# EAGLE design simhid-g1000_right (EAGLE 9.6.2)
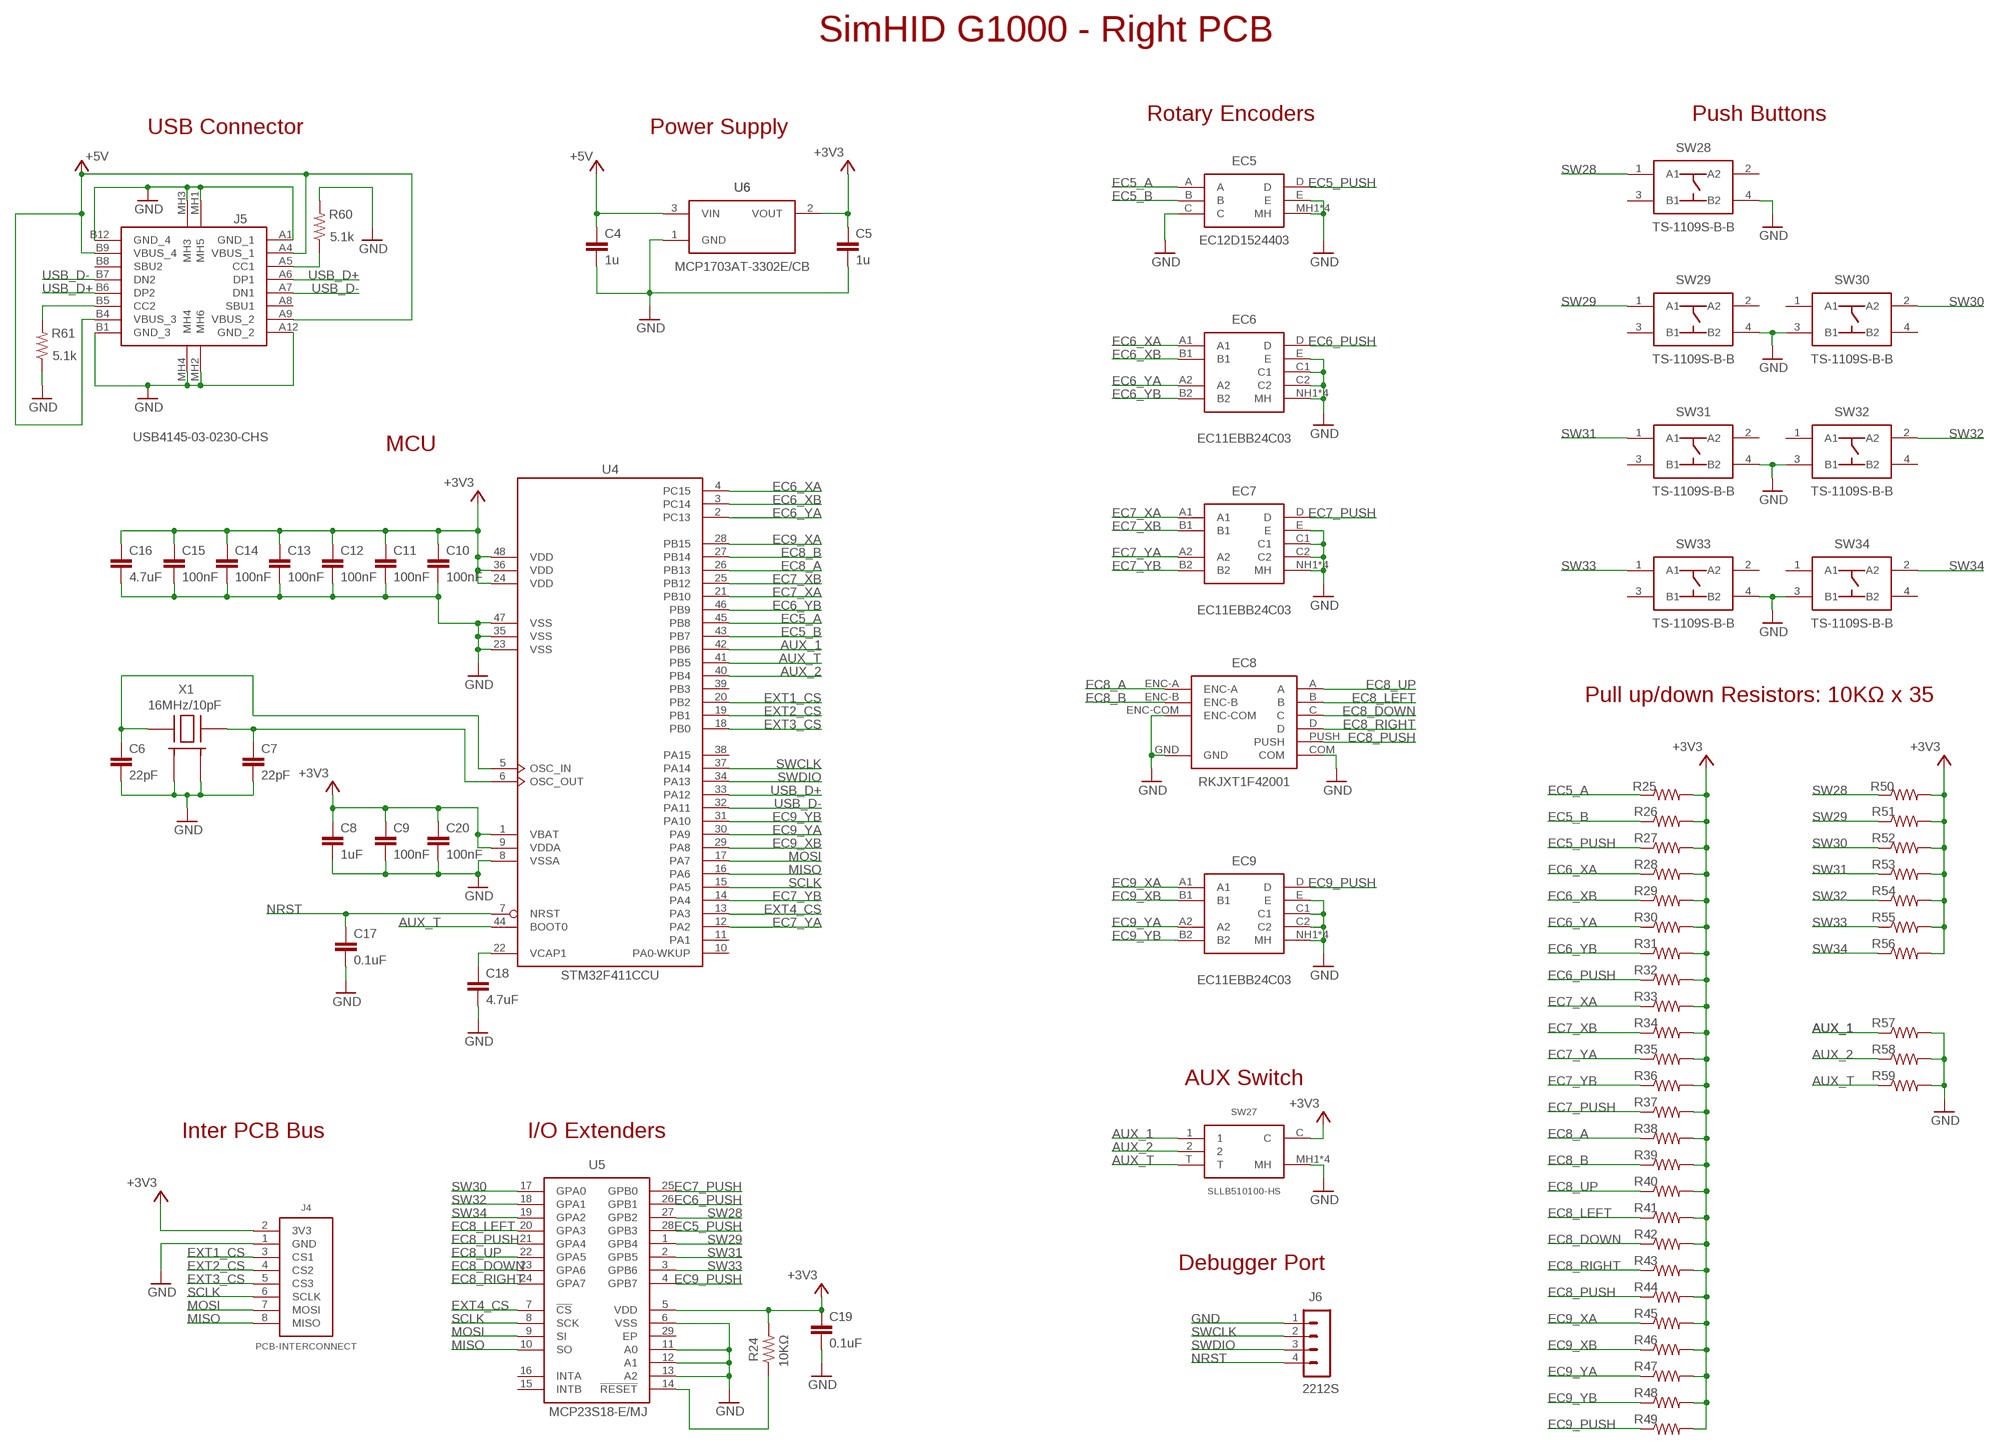
[diagram p0: schematic, sheet 1]

## Parts
C4  1u  RCL_C-EUC0402-HS  [RCL_C0402_HS]
C5  1u  RCL_C-EUC0402-HS  [RCL_C0402_HS]
C6  22pF  RCL_C-EUC0402-HS  [RCL_C0402_HS]
C7  22pF  RCL_C-EUC0402-HS  [RCL_C0402_HS]
C8  1uF  RCL_C-EUC0402-HS  [RCL_C0402_HS]
C9  100nF  RCL_C-EUC0402-HS  [RCL_C0402_HS]
C10  100nF  RCL_C-EUC0402-HS  [RCL_C0402_HS]
C11  100nF  RCL_C-EUC0402-HS  [RCL_C0402_HS]
C12  100nF  RCL_C-EUC0402-HS  [RCL_C0402_HS]
C13  100nF  RCL_C-EUC0402-HS  [RCL_C0402_HS]
C14  100nF  RCL_C-EUC0402-HS  [RCL_C0402_HS]
C15  100nF  RCL_C-EUC0402-HS  [RCL_C0402_HS]
C16  4.7uF  RCL_C-EUC0402-HS  [RCL_C0402_HS]
C17  0.1uF  RCL_C-EUC0402-HS  [RCL_C0402_HS]
C18  4.7uF  RCL_C-EUC0402-HS  [RCL_C0402_HS]
C19  0.1uF  RCL_C-EUC0402-HS  [RCL_C0402_HS]
C20  100nF  RCL_C-EUC0402-HS  [RCL_C0402_HS]
EC5  EC12D1524403  [EC12D1524403]
EC6  EC11EBB24C03  [EC11EBB24C03]
EC7  EC11EBB24C03  [EC11EBB24C03]
EC8  RKJXT1F42001  [RKJXT1F42001]
EC9  EC11EBB24C03  [EC11EBB24C03]
J4  PCB-INTERCONNECT  [PCB-INTERCONNECT]
J5  USB4145-03-0230-CHS  [USB4145030230C-HS]
J6  2212S  53047-0410  [53047-0410]
R24  10KΩ  RCL_R-US_R0402-HS  [RCL_R0402_HS]
R25  RCL_R-US_R0402-HS  [RCL_R0402_HS]
R26  RCL_R-US_R0402-HS  [RCL_R0402_HS]
R27  RCL_R-US_R0402-HS  [RCL_R0402_HS]
R28  RCL_R-US_R0402-HS  [RCL_R0402_HS]
R29  RCL_R-US_R0402-HS  [RCL_R0402_HS]
R30  RCL_R-US_R0402-HS  [RCL_R0402_HS]
R31  RCL_R-US_R0402-HS  [RCL_R0402_HS]
R32  RCL_R-US_R0402-HS  [RCL_R0402_HS]
R33  RCL_R-US_R0402-HS  [RCL_R0402_HS]
R34  RCL_R-US_R0402-HS  [RCL_R0402_HS]
R35  RCL_R-US_R0402-HS  [RCL_R0402_HS]
R36  RCL_R-US_R0402-HS  [RCL_R0402_HS]
R37  RCL_R-US_R0402-HS  [RCL_R0402_HS]
R38  RCL_R-US_R0402-HS  [RCL_R0402_HS]
R39  RCL_R-US_R0402-HS  [RCL_R0402_HS]
R40  RCL_R-US_R0402-HS  [RCL_R0402_HS]
R41  RCL_R-US_R0402-HS  [RCL_R0402_HS]
R42  RCL_R-US_R0402-HS  [RCL_R0402_HS]
R43  RCL_R-US_R0402-HS  [RCL_R0402_HS]
R44  RCL_R-US_R0402-HS  [RCL_R0402_HS]
R45  RCL_R-US_R0402-HS  [RCL_R0402_HS]
R46  RCL_R-US_R0402-HS  [RCL_R0402_HS]
R47  RCL_R-US_R0402-HS  [RCL_R0402_HS]
R48  RCL_R-US_R0402-HS  [RCL_R0402_HS]
R49  RCL_R-US_R0402-HS  [RCL_R0402_HS]
R50  RCL_R-US_R0402-HS  [RCL_R0402_HS]
R51  RCL_R-US_R0402-HS  [RCL_R0402_HS]
R52  RCL_R-US_R0402-HS  [RCL_R0402_HS]
R53  RCL_R-US_R0402-HS  [RCL_R0402_HS]
R54  RCL_R-US_R0402-HS  [RCL_R0402_HS]
R55  RCL_R-US_R0402-HS  [RCL_R0402_HS]
R56  RCL_R-US_R0402-HS  [RCL_R0402_HS]
R57  RCL_R-US_R0402-HS  [RCL_R0402_HS]
R58  RCL_R-US_R0402-HS  [RCL_R0402_HS]
R59  RCL_R-US_R0402-HS  [RCL_R0402_HS]
R60  5.1k  RCL_R-US_R0402-HS  [RCL_R0402_HS]
R61  5.1k  RCL_R-US_R0402-HS  [RCL_R0402_HS]
SW27  SLLB510100-HS  [SLLB510100-HS]
SW28  TS-1109S-B-B  [TS-1109S-B-B]
SW29  TS-1109S-B-B  [TS-1109S-B-B]
SW30  TS-1109S-B-B  [TS-1109S-B-B]
SW31  TS-1109S-B-B  [TS-1109S-B-B]
SW32  TS-1109S-B-B  [TS-1109S-B-B]
SW33  TS-1109S-B-B  [TS-1109S-B-B]
SW34  TS-1109S-B-B  [TS-1109S-B-B]
U4  STM32F411CCU  [UFQFPN48]
U5  MCP23S18-E/MJ  MCP23S17-E_ML  [QFN65P600X600X100-29N]
U6  MCP1703AT-3302E/CB  LDO-REGULATOR  [SOT23]
X1  16MHz/10pF  CRYSTAL3225HS  [CRYSTAL3225-HS]

## Nets
+3V3 [pwr]: C5.1 C8.1 C9.1 C10.1 C11.1 C12.1 C13.1 C14.1 C15.1 C16.1 C19.1 C20.1 J4.2(3V3) R24.2 R25.2 R26.2 R27.2 R28.2 R29.2 R30.2 R31.2 R32.2 R33.2 R34.2 R35.2 R36.2 R37.2 R38.2 R39.2 R40.2 R41.2 R42.2 R43.2 R44.2 R45.2 R46.2 R47.2 R48.2 R49.2 R50.2 R51.2 R52.2 R53.2 R54.2 R55.2 R56.2 SW27.C U4.1(VBAT) U4.9(VDDA) U4.24(VDD) U4.36(VDD) U4.48(VDD) U5.5(VDD) U6.2(VOUT)
+5V [pwr]: C4.1 J5.A4(VBUS_1) J5.A9(VBUS_2) J5.B4(VBUS_3) J5.B9(VBUS_4) U6.3(VIN)
AUX_1: R57.1 SW27.1 U4.42(PB6)
AUX_2: R58.1 SW27.2 U4.40(PB4)
AUX_T: R59.1 SW27.T U4.41(PB5) U4.44(BOOT0)
EC5_A: EC5.A R25.1 U4.45(PB8)
EC5_B: EC5.B R26.1 U4.43(PB7)
EC5_PUSH: EC5.D R27.1 U5.28(GPB3)
EC6_PUSH: EC6.D R32.1 U5.26(GPB1)
EC6_XA: EC6.A1 R28.1 U4.4(PC15)
EC6_XB: EC6.B1 R29.1 U4.3(PC14)
EC6_YA: EC6.A2 R30.1 U4.2(PC13)
EC6_YB: EC6.B2 R31.1 U4.46(PB9)
EC7_PUSH: EC7.D R37.1 U5.25(GPB0)
EC7_XA: EC7.A1 R33.1 U4.21(PB10)
EC7_XB: EC7.B1 R34.1 U4.25(PB12)
EC7_YA: EC7.A2 R35.1 U4.12(PA2)
EC7_YB: EC7.B2 R36.1 U4.14(PA4)
EC8_A: EC8.ENC-A R38.1 U4.26(PB13)
EC8_B: EC8.ENC-B R39.1 U4.27(PB14)
EC8_DOWN: EC8.C R42.1 U5.23(GPA6)
EC8_LEFT: EC8.B R41.1 U5.20(GPA3)
EC8_PUSH: EC8.PUSH R44.1 U5.21(GPA4)
EC8_RIGHT: EC8.D R43.1 U5.24(GPA7)
EC8_UP: EC8.A R40.1 U5.22(GPA5)
EC9_PUSH: EC9.D R49.1 U5.4(GPB7)
EC9_XA: EC9.A1 R45.1 U4.28(PB15)
EC9_XB: EC9.B1 R46.1 U4.29(PA8)
EC9_YA: EC9.A2 R47.1 U4.30(PA9)
EC9_YB: EC9.B2 R48.1 U4.31(PA10)
EXT1_CS: J4.3(CS1) U4.20(PB2)
EXT2_CS: J4.4(CS2) U4.19(PB1)
EXT3_CS: J4.5(CS3) U4.18(PB0)
EXT4_CS: U4.13(PA3) U5.7(!CS)
GND [gnd]: C4.2 C5.2 C6.2 C7.2 C8.2 C9.2 C10.2 C11.2 C12.2 C13.2 C14.2 C15.2 C16.2 C17.2 C18.2 C19.2 C20.2 EC5.C EC5.E EC5.MH1(MH) EC5.MH2(MH) EC5.MH3(MH) EC5.MH4(MH) EC6.C1 EC6.C2 EC6.E EC6.NH1(MH) EC6.NH2(MH) EC6.NH3(MH) EC6.NH4(MH) EC7.C1 EC7.C2 EC7.E EC7.NH1(MH) EC7.NH2(MH) EC7.NH3(MH) EC7.NH4(MH) EC8.COM EC8.ENC-COM EC8.GND EC9.C1 EC9.C2 EC9.E EC9.NH1(MH) EC9.NH2(MH) EC9.NH3(MH) EC9.NH4(MH) J4.1(GND) J5.A1(GND_1) J5.A12(GND_2) J5.B1(GND_3) J5.B12(GND_4) J5.MH1(MH5) J5.MH2(MH6) J5.MH3 J5.MH4 J6.1 R57.2 R58.2 R59.2 R60.2 R61.1 SW27.MH1(MH) SW27.MH2(MH) SW27.MH3(MH) SW27.MH4(MH) SW28.4(B2) SW29.4(B2) SW30.3(B1) SW31.4(B2) SW32.3(B1) SW33.4(B2) SW34.3(B1) U4.8(VSSA) U4.23(VSS) U4.35(VSS) U4.47(VSS) U5.6(VSS) U5.11(A0) U5.12(A1) U5.13(A2) U6.1(GND) X1.2(GND_1) X1.4(GND_2)
MISO: J4.8(MISO) U4.16(PA6) U5.10(SO)
MOSI: J4.7(MOSI) U4.17(PA7) U5.9(SI)
N$1: R24.1 U5.14(!RESET)
N$3: J5.A5(CC1) R60.1
N$4: J5.B5(CC2) R61.2
NRST: C17.1 J6.4 U4.7(NRST)
OSC_IN: C6.1 U4.5(OSC_IN) X1.1(HOT_1)
OSC_OUT: C7.1 U4.6(OSC_OUT) X1.3(HOT_2)
SCLK: J4.6(SCLK) U4.15(PA5) U5.8(SCK)
SW28: R50.1 SW28.1(A1) U5.27(GPB2)
SW29: R51.1 SW29.1(A1) U5.1(GPB4)
SW30: R52.1 SW30.2(A2) U5.17(GPA0)
SW31: R53.1 SW31.1(A1) U5.2(GPB5)
SW32: R54.1 SW32.2(A2) U5.18(GPA1)
SW33: R55.1 SW33.1(A1) U5.3(GPB6)
SW34: R56.1 SW34.2(A2) U5.19(GPA2)
SWCLK: J6.2 U4.37(PA14)
SWDIO: J6.3 U4.34(PA13)
USB_D+: J5.A6(DP1) J5.B6(DP2) U4.33(PA12)
USB_D-: J5.A7(DN1) J5.B7(DN2) U4.32(PA11)
VCAP: C18.1 U4.22(VCAP1)
Unconnected: J5.A8(SBU1) J5.B8(SBU2) SW28.2(A2) SW28.3(B1) SW29.2(A2) SW29.3(B1) SW30.1(A1) SW30.4(B2) SW31.2(A2) SW31.3(B1) SW32.1(A1) SW32.4(B2) SW33.2(A2) SW33.3(B1) SW34.1(A1) SW34.4(B2) U4.10(PA0-WKUP) U4.11(PA1) U4.38(PA15) U4.39(PB3) U5.15(INTB) U5.16(INTA) U5.29(EP)

## Notes on the sheet
- SimHID G1000 - Right PCB
- Rotary Encoders | Push Buttons
- USB Connector | Power Supply
- MCU
- Pull up/down Resistors: 10KΩ x 35
- AUX Switch
- Inter PCB Bus | I/O Extenders
- Debugger Port

## Library data of the parts
C4-C20 = gen-discrete3:RCL_C-EU: CAPACITOR, European symbol
EC5 = RotaryEncoder:EC12D1524403
EC6 EC7 EC9 = RotaryEncoder:EC11EBB24C03
EC8 = RotaryEncoder:RKJXT1F42001
J4 = SimHID-G1000:PCB-INTERCONNECT
J5 = typec_connectors:USB4145-03-0230-C: USB Connectors USB-C Rec 3u" Vert 16P SMT 2.3mm TH stakes H7.46mm T+R+Cap Source: Datasheet <https://gct.co/newark/connector/USB4145>
J6 = connector:53047-0410: HEADER
R24-R61 = gen-discrete3:RCL_R-US_: RESISTOR, American symbol
SW27 = Switches:SLLB510100
SW28-SW34 = Switches:TS-1109S-B-B
U4 = stm32:STM32F411CCU*
U5 = MCP23S17-E_ML:MCP23S17-E_ML: 16-Bit I/O Port Expander SPI 10M QFN28EP Microchip MCP23S17-E/ML, 16-channel 16bit I/O Expander 10MHz, Serial-SPI, 28-Pin QFN Source: Datasheet <http://docs-emea.rs-online.com/webdocs/1169/0900766b811692f9.pdf>; ARROW_PART_NUMBER: MCP23S17-E/ML; ARROW_PRICE-STOCK: https://www.arrow.com/en/products/mcp23s17-eml/microchip-technology; DESCRIPTION: 16-Bit I/O Port Expander SPI 10M QFN28EP Microchip MCP23S17-E/ML, 16-channel 16bit I/O Expander 10MHz, Serial-SPI, 28-Pin QFN; HEIGHT: 1mm; MANUFACTURER_NAME: Microchip; MANUFACTURER_PART_NUMBER: MCP23S17-E/ML; MOUSER_PART_NUMBER: 579-MCP23S17-E/ML; MOUSER_PRICE-STOCK: https://www.mouser.co.uk/ProductDetail/Microchip-Technology/MCP23S17-E-ML/?qs=usxtMOJb1RyqBjk32jXtPQ%3D%3D
U6 = SOT23_Module:LDO-REGULATOR
X1 = CRYSTAL3225:CRYSTAL3225: Crystals 3225

## Net classes
1 gnd: width 0.2 mm
2 pwr: width 0.2 mm

## Board
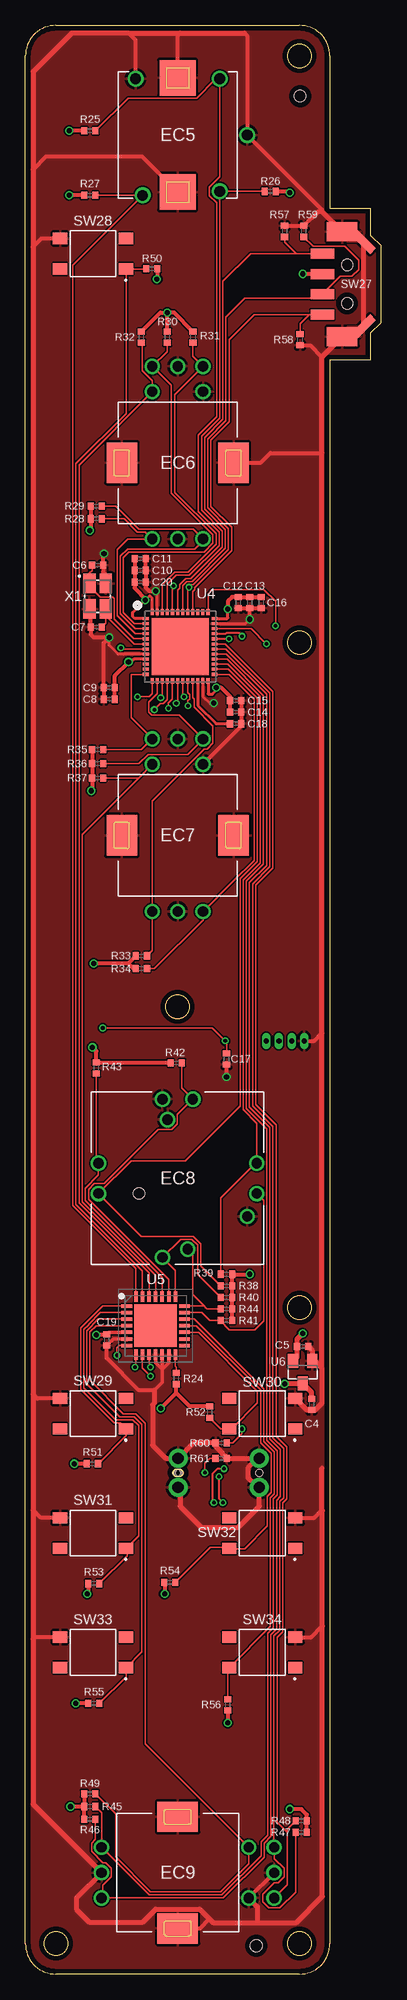
[diagram p1: board, top side]
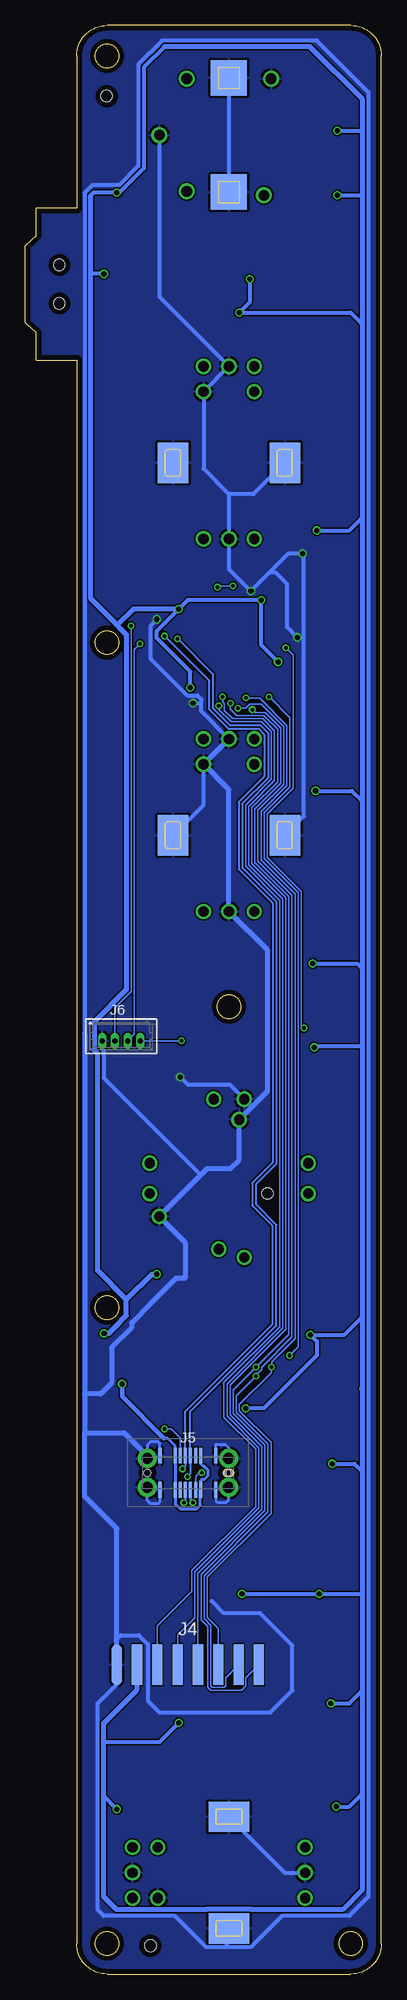
[diagram p2: board, bottom side, seen from below]

Size 35.05 x 192 mm. Coordinates in mm from the lower left corner, seen from the top.
Outline: 30,189 30,174 34,174 34,171.3 35.05,170.3 35.05,162.7 34,161.7 34,159 30,159 30,3 arc-90 27,0 3,0 arc-90 0,3 0,189 arc-90 3,192 27,192 arc-90 30,189
Outline: circle at 27,65.68 radius 1.15
Outline: circle at 27,3 radius 1.15
Outline: circle at 3,3 radius 1.15
Outline: circle at 27,131.19 radius 1.15
Outline: circle at 15,95.3 radius 1.15
Outline: circle at 27,189 radius 1.15
Copper layers (1*16): Top 0.035mm / dielectric 1.6mm / Bottom 0.035mm
Design rules "Elecrow_2-layer_PCB_eagle_rule": minimum track width 6mil, minimum drill 12mil, track to track 6mil, track to pad 6mil, pad to pad 6mil, via to via 8mil, smd to smd 0mil, copper to edge 20mil, drill to drill 10mil, minimum pad ring 6mil, minimum via ring 6mil, stop-mask expansion 0mil, vias tented up to drill 100mil, thermal gap 10mil
Holes 2.3 mm at 27,189 27,131.19 15,95.3 27,65.68 27,3 3,3
Holes 1.15 mm at 27.05,185.04 22.73,2.79

### Footprints (pad centres in the part's own frame; a part is rotated, then mirrored left to right if it is on the bottom)
RCL_C0402_HS = smd 0.6 x 0.7: 1 -0.55,0; 2 0.55,0
EC12D1524403 = drill 1.05: A 5.55,-4.15; B -5.55,-4.15; C 5.55,4.15; D -5.95,3.45; E 0,-6.85 | smd 3.5 x 3.55: MH1 -5.625,0; MH3 5.625,0 | smd 3.5 x 3.55 bottom: MH2 -5.625,0; MH4 5.625,0
EC11EBB24C03 = drill 1: A1 2.5,7.5; A2 2.5,-9.5; B1 -2.5,7.5; B2 -2.5,-9.5; C1 0,7.5; C2 0,-9.5; D 2.5,-7; E -2.5,-7 | smd 3 x 4: NH1 5.5,0; NH3 -5.5,0 | smd 3 x 4 bottom: NH2 5.5,0; NH4 -5.5,0
RKJXT1F42001 = drill 1: A -1.5,-7.8; B 7.8,-1.5; C 1.5,7.8; COM -1,5.78; D -7.8,1.5; ENC-A -7.8,-1.5; ENC-B 7.8,1.5; ENC-COM -1.5,7.8; GND 6.86,-3.75; PUSH 1,-6.98 | hole 1.1: -3.8,-1.5
PCB-INTERCONNECT = smd 1 x 4: 1 -7,0; 2 -5,0; 3 -3,0; 4 -1,0; 5 1,0; 6 3,0; 7 5,0; 8 7,0
USB4145030230C-HS = smd 0.3 x 1.55: A1 -2.75,1.685; A4 -1.25,1.685; A5 -0.75,1.685; A6 -0.25,1.685; A7 0.25,1.685; A8 0.75,1.685; A9 1.25,1.685; A12 2.75,1.685; B1 2.75,-1.685; B4 1.25,-1.685; B5 0.75,-1.685; B6 0.25,-1.685; B7 -0.25,-1.685; B8 -0.75,-1.685; B9 -1.25,-1.685; B12 -2.75,-1.685 | drill 1.1 pad 1.875: MH1 -4,1.43; MH2 4,1.43; MH3 -4,-1.43; MH4 4,-1.43 | hole 0.71: -4,0; 4,0; 4.15,0; 3.85,0
53047-0410 = drill 0.508 long: 1 1.875,0; 2 0.625,0; 3 -0.625,0; 4 -1.875,0
RCL_R0402_HS = smd 0.6 x 0.7: 1 -0.55,0; 2 0.55,0
SLLB510100-HS = smd 1 x 2.3: 1 -3,-1.45; 2 3,-1.45; C -1,-1.45; T 1,-1.45 | smd 2.6 x 0.8 rotated 45: MH1 -4.172,2.616 | smd 2.6 x 0.8 rotated 315: MH2 4.172,2.616 | smd 1.85 x 3: MH3 -5.175,0.5; MH4 5.175,0.5 | hole 1.1: 1.9,1; -1.9,1
TS-1109S-B-B = smd 1.4 x 1.1: 1 -3.25,1.5; 2 3.25,1.5; 3 -3.25,-1.5; 4 3.25,-1.5
UFQFPN48 = smd 0.55 x 0.3: 1 -3.38,2.75; 2 -3.38,2.25; 3 -3.38,1.75; 4 -3.38,1.25; 5 -3.38,0.75; 6 -3.38,0.25; 7 -3.38,-0.25; 8 -3.38,-0.75; 9 -3.38,-1.25; 10 -3.38,-1.75; 11 -3.38,-2.25; 12 -3.38,-2.75; 25 3.38,-2.75; 26 3.38,-2.25; 27 3.38,-1.75; 28 3.38,-1.25; 29 3.38,-0.75; 30 3.38,-0.25; 31 3.38,0.25; 32 3.38,0.75; 33 3.38,1.25; 34 3.38,1.75; 35 3.38,2.25; 36 3.38,2.75 | smd 0.3 x 0.55: 13 -2.75,-3.38; 14 -2.25,-3.38; 15 -1.75,-3.38; 16 -1.25,-3.38; 17 -0.75,-3.38; 18 -0.25,-3.38; 19 0.25,-3.38; 20 0.75,-3.38; 21 1.25,-3.38; 22 1.75,-3.38; 23 2.25,-3.38; 24 2.75,-3.38; 37 2.75,3.38; 38 2.25,3.38; 39 1.75,3.38; 40 1.25,3.38; 41 0.75,3.38; 42 0.25,3.38; 43 -0.25,3.38; 44 -0.75,3.38; 45 -1.25,3.38; 46 -1.75,3.38; 47 -2.25,3.38; 48 -2.75,3.38 | smd 5.6 x 5.6: EXP 0,0
QFN65P600X600X100-29N = smd 1.05 x 0.35: 1 -2.85,1.95; 2 -2.85,1.3; 3 -2.85,0.65; 4 -2.85,0; 5 -2.85,-0.65; 6 -2.85,-1.3; 7 -2.85,-1.95; 15 2.85,-1.95; 16 2.85,-1.3; 17 2.85,-0.65; 18 2.85,0; 19 2.85,0.65; 20 2.85,1.3; 21 2.85,1.95 | smd 0.35 x 1.05: 8 -1.95,-2.85; 9 -1.3,-2.85; 10 -0.65,-2.85; 11 0,-2.85; 12 0.65,-2.85; 13 1.3,-2.85; 14 1.95,-2.85; 22 1.95,2.85; 23 1.3,2.85; 24 0.65,2.85; 25 0,2.85; 26 -0.65,2.85; 27 -1.3,2.85; 28 -1.95,2.85 | smd 4.2 x 4.2: 29 0,0
SOT23 = smd 1 x 1.4: 1 -0.95,-1.1; 2 0.95,-1.1; 3 0,1.1
CRYSTAL3225-HS = smd 1.9 x 1.2: 1 -1.26,-0.8; 2 1.26,-0.8; 3 1.26,0.8; 4 -1.26,0.8

### Placement (x,y rotation side)
C4  28.19,56.13 270 top
C5  27.3,61.85 0 top
C6  7.11,138.81 0 top
C7  6.99,132.72 180 top
C8  8.26,125.6 180 top
C9  8.26,126.75 180 top
C10  11.3,138.3 0 top
C11  11.3,139.45 0 top
C12  20.95,135.13 270 top
C13  22.1,135.13 270 top
C14  20.7,124.33 0 top
C15  20.7,125.48 0 top
C16  23.24,135.13 270 top
C17  19.81,90.17 270 top
C18  20.7,123.19 0 top
C19  8,62.48 270 top
C20  11.3,137.16 0 top
EC5  15,181.2 90 top
EC6  15,148.9 180 top
EC7  15,112.2 180 top
EC8  15,78.4 0 top
EC9  15,10 90 top
J4  19.05,30.48 0 bottom
J5  19.04,49.4 0 bottom
J6  25.6,91.94 180 bottom
R24  14.86,58.67 270 top
R25  6.35,181.61 180 top
R26  24.13,175.64 0 top
R27  6.35,175.26 180 top
R28  6.99,143.38 180 top
R29  6.99,144.65 180 top
R30  13.97,161.29 90 top
R31  16.51,161.29 90 top
R32  11.43,161.29 90 top
R33  11.43,100.33 180 top
R34  11.43,99.06 180 top
R35  7.11,120.65 180 top
R36  7.11,119.25 180 top
R37  7.11,117.86 180 top
R38  19.81,67.82 0 top
R39  19.81,68.96 0 top
R40  19.81,66.67 0 top
R41  19.81,64.39 0 top
R42  14.86,89.79 180 top
R43  6.99,89.28 90 top
R44  19.81,65.53 0 top
R45  6.35,16.51 180 top
R46  6.35,15.24 180 top
R47  27.18,13.97 0 top
R48  27.18,15.11 0 top
R49  6.35,17.78 180 top
R50  12.45,168.02 0 top
R51  6.6,50.29 180 top
R52  18.16,55.37 90 top
R53  6.73,38.48 180 top
R54  14.22,38.61 180 top
R55  6.73,26.67 180 top
R56  19.94,26.54 270 top
R57  25.53,171.7 90 top
R58  27.05,161.04 270 top
R59  27.43,171.7 90 top
R60  19.28,52.32 180 top
R61  19.28,50.8 180 top
SW27  30.7,166.5 270 top
SW28  6.67,169.5 180 top
SW29  6.67,55.22 180 top
SW30  23.33,55.22 180 top
SW31  6.67,43.46 180 top
SW32  23.33,43.46 180 top
SW33  6.67,31.7 180 top
SW34  23.33,31.7 180 top
U4  15.24,130.81 0 top
U5  12.83,63.88 0 top
U6  27.3,59.31 180 top
X1  7.11,135.76 270 top

### Tracks (layer width: path | path; a pad name or v marks a point on that pad's centre or on a via)
+3V3  (via drill 0.5)
  Top 0.3: U4.48 12.49,135.59 12.32,135.76 12.19,135.76 11.87,135.45 v11.81,135.38 10.57,134.15 10.57,133.76 10.78,133.56 U4.1 | U4.24 17.99,126.16 18.03,126.11 18.41,126.11 18.8,126.49 v18.8,126.75 | U4.9 10.69,129.56 10.41,129.29 v10.16,129.29 | U4.36 19.89,133.56 19.94,133.6 v19.94,134.49
  Top 0.35: U5.5 8.2,63.23 C19.1
  Top 0.4: v27.3,167.51 29.24,167.51 SW27.C | R25.2 v4.32,181.61 | R27.2 v4.32,175.26 | R26.2 25.91,175.64 v26.04,175.51 | R30.2 v13.97,163.7 | R32.2 13.29,163.7 v13.97,163.7 | R31.2 14.65,163.7 v13.97,163.7 | R33.2 10.12,99.57 | 10.12,99.57 v6.73,99.57 | R34.2 10.63,99.06 10.12,99.57 | R35.2 R36.2 R37.2 6.56,116.67 v6.48,116.59 | R41.2 R44.2 R40.2 R38.2 R39.2 v22.1,68.96 | R42.2 7.03,89.79 R43.2 6.99,90.93 v6.6,91.31 | R47.2 R48.2 27.73,15.71 27.18,16.26 v26.04,16.26 | R49.2 R45.2 | R46.2 R45.2 | R45.2 v4.45,16.51 | R50.2 13,167.05 v12.95,167 | R51.2 v4.83,50.29 | R55.2 v4.95,26.67 | R56.2 v19.94,24.77 | C8.1 C9.1 8.8,127.93 v10.16,129.29 | R29.2 R28.2 6.43,142.32 v6.35,142.24 | C11.1 C10.1 C20.1 10.75,136.57 11.87,135.45 | v19.94,134.49 19.94,135.25 20.36,135.68 C12.1 C13.1 C16.1 | v18.8,126.75 19.3,126.75 20.15,125.9 C15.1 C14.1 | v13.34,55.75 14.86,57.28 | 14.86,57.28 R24.2 | R52.2 16.21,55.92 14.86,57.28 | v6.99,62.99 7.03,63.03 C19.1 | R54.2 13.72,38.57 v13.72,37.47 | R53.2 6.18,37.55 v6.1,37.47
  Top 0.5: U6.2 26.75,60.81 C5.1 26.75,62.57 v27.3,63.12
  Bottom 0.4: v27.3,167.51 28.48,167.51 28.61,167.64 | 28.61,175.26 28.35,175.51 v26.04,175.51 25.78,175.51 23.37,177.93 23.37,187.87 21.34,189.9 | v4.32,175.26 1.87,175.26 | v4.32,181.61 1.87,181.61 | 2,57.66 1.87,57.78 | 1.87,162.56 3.02,163.7 v13.97,163.7 12.95,164.72 v12.95,167 | v6.73,99.57 2.38,99.57 1.87,99.06 | v6.48,116.59 2.89,116.59 1.87,115.57 | v22.1,68.96 22.6,68.96 | v6.6,91.31 6.48,91.44 1.87,91.44 | v26.04,16.26 27.34,17.56 27.34,17.78 | v4.45,16.51 3.14,16.51 1.87,17.78 | v4.83,50.29 2.63,50.29 1.87,49.53 | v13.72,37.47 v6.1,37.47 1.87,37.47 | v4.95,26.67 3.14,26.67 1.87,27.94 | v19.94,24.77 21.84,22.86 27.34,22.86 | v6.35,142.24 3.14,142.24 1.87,143.51 | v18.8,126.75 18.8,128.32 22.14,131.67 22.14,132.29 v19.94,134.49 19.05,135.38 v11.81,135.38 11.81,130.94 v10.16,129.29 | 1.87,64.77 3.65,62.99 v6.99,62.99 6.35,62.36 6.35,60.96 11.56,55.75 v13.34,55.75
  Bottom 0.5: 25.99,132.89 25.59,132.49 25.59,132.48 25.09,131.98 25.09,97 28.28,93.81 28.28,91.02 27.94,90.68 27.94,69.32 25.09,66.48 | 25.99,132.89 28.61,135.51 28.61,167.64 28.61,175.26 | J4.2 24.05,28.02 27.34,24.73 27.34,22.86 27.34,17.78 27.34,7.62 26.07,6.35 21.52,6.35 17.22,6.35 17.17,6.4 12.83,6.4 12.78,6.35 3.81,6.35 1.87,8.29 1.87,17.78 1.87,27.94 1.87,37.47 1.87,49.53 1.87,57.78 1.87,64.77 1.87,91.44 1.87,99.06 1.87,115.57 1.87,143.51 1.87,162.56 1.87,175.26 1.87,181.61 1.87,184.75 7.02,189.9 21.34,189.9 | v19.94,134.49 24.38,134.49 25.99,132.89 | 25.09,66.48 25.09,64.89 25.59,64.39 25.65,64.32 25.71,64.27 26.86,63.12 v27.3,63.12 | 22.6,68.96 22.61,68.96 25.09,66.48
+5V  (via drill 0.5)
  Top 0.5: v25.53,58.17 25.57,58.21 U6.3 28.19,57.32 C4.1
  Bottom 0.3: 21.41,52.77 21.02,52.77 20.29,52.04 J5.A4 J5.B9 20.29,46.33 19.79,45.83 18.18,45.83 17.8,46.21 J5.B4 17.78,47.72 17.78,48.64 17.65,48.77 17.41,48.77 17.05,49.14 17.05,49.66 17.41,50.03 17.53,50.03 17.79,50.29 J5.A9
  Bottom 0.45: v25.53,58.17 25.53,56.9 21.41,52.77
AUX_1
  Top 0.152: SW27.1 26.67,169.5 | 26.67,169.5 22.18,169.5 19.45,166.78 19.45,153.19 17.65,151.38 17.65,144.36 19.7,142.31 19.7,140.49 16.41,137.21 15.9,137.21 15.49,136.8 U4.42 | R57.1 25.53,170.64 26.67,169.5
AUX_2
  Top 0.152: SW27.2 27.94,163.5 | 27.94,163.5 22.53,163.5 20.06,161.03 20.06,152.93 18.26,151.13 18.26,144.61 20.31,142.56 20.31,140.24 16.68,136.62 16.68,136.42 16.49,136.23 U4.40 | R58.1 27.05,162.61 27.94,163.5
AUX_T  (via drill 0.35)
  Top 0.152: U4.44 14.49,136.66 v14.61,136.78 | U4.41 15.99,136.51 v16.13,136.65 16.38,136.9 16.54,136.9 20,140.36 20,142.44 17.96,144.48 17.96,151.26 19.76,153.06 19.76,163.27 21.59,165.1 28.85,165.1 SW27.T 31.02,167.27 32.17,167.27 32.83,167.93 32.83,168.87 31.48,170.23 28.36,170.23 R59.1
  Bottom 0.152: v14.61,136.78 16,136.78 v16.13,136.65
EC5_A
  Top 0.152: EC5.A 19.15,186.69 | 19.15,186.69 19.15,177.09 18.13,176.07 18.13,175.23 18.84,174.52 18.84,153.44 17.04,151.64 17.04,144.1 19.09,142.06 19.09,140.74 16.16,137.82 14.86,137.82 13.99,136.95 U4.45 | 19.15,186.69 18.71,186.69 16.87,184.85 10.14,184.85 R25.1
EC5_B
  Top 0.152: U4.43 14.99,136.38 15.19,136.57 15.19,136.93 15.77,137.51 16.29,137.51 19.39,140.62 19.39,142.19 17.35,144.23 17.35,151.51 19.15,153.31 EC5.B R26.1
EC5_PUSH
  Top 0.152: EC5.D 11.49,175.19 | 11.49,175.19 4.67,168.37 4.67,75.72 10.88,69.52 U5.28 | R27.1 11.43,175.26 11.49,175.19
EC6_PUSH
  Top 0.152: R32.1 11.52,160.65 11.52,158 12.5,157.02 EC6.D 5.28,148.68 5.28,75.97 12.18,69.08 U5.26
EC6_XA
  Top 0.152: R28.1 9.73,143.38 11.04,142.07 11.83,142.07 EC6.A1 10.08,141.4 9.04,140.36 9.04,133.83 10.81,132.06 U4.4
EC6_XB
  Top 0.152: R29.1 8.89,144.65 11.16,142.38 16.52,142.38 EC6.B1 17.5,141.25 16.67,140.42 10.07,140.42 9.35,139.7 9.35,134.02 10.81,132.56 U4.3
EC6_YA
  Top 0.152: R30.1 13.97,159.87 EC6.A2 14.35,156.55 14.35,145.93 18.48,141.81 18.48,141 17.6,140.12 10.2,140.12 9.65,139.57 9.65,134.15 10.74,133.06 U4.2
EC6_YB
  Top 0.152: U4.46 13.49,136.88 14.73,138.12 16.04,138.12 18.78,140.87 18.78,141.93 14.73,145.98 14.73,155.63 EC6.B2 16.51,159.39 R31.1
EC7_PUSH
  Top 0.152: EC7.D 11.15,117.86 | 11.15,117.86 5.59,112.29 5.59,76.1 12.83,68.86 U5.25 | R37.1 11.15,117.86
EC7_XA
  Top 0.152: R33.1 12.5,100.85 EC7.A1 12.5,115.58 17.64,120.72 17.91,120.72 18.48,121.3 18.48,122.97 16.61,124.84 16.61,125.63 16.49,125.75 U4.21
EC7_XB
  Top 0.152: R34.1 12.7,99.06 17.5,103.86 EC7.B1 20.44,107.64 20.45,107.64 22.53,109.73 22.53,125.6 20.07,128.06 U4.25
EC7_YA
  Top 0.152: 12.5,121.72 EC7.A2 | R35.1 11.43,120.65 12.5,121.72 | U4.12 10.46,128.06 10.41,128.02 10.41,123.81 12.5,121.72
EC7_YB
  Top 0.152: R36.1 11.17,119.25 12.1,120.18 15.98,120.18 EC7.B2 15.17,124.03 12.47,124.03 12.14,124.36 12.14,125.33 12.99,126.17 U4.14
EC8_A
  Top 0.152: R38.1 17.28,69.8 17.28,71.95 16.53,72.7 11.4,72.7 EC8.ENC-A 10.44,80.14 15.75,80.14 21.16,85.55 21.16,107.92 22.84,109.61 22.84,125.72 20,128.56 U4.26
EC8_B
  Top 0.152: 22.8,80.01 22.8,83.83 21.46,85.17 21.46,107.8 23.14,109.48 23.14,125.85 19.93,129.06 U4.27 | 22.8,80.01 EC8.ENC-B | R39.1 19.26,76.47 22.8,80.01
EC8_DOWN
  Top 0.152: R42.1 15.41,87.29 EC8.C 14.98,84.68 14.98,83.78 14.4,83.2 13.07,83.2 7.75,77.88 6.79,77.88 6.22,77.31 6.22,76.33 14.13,68.42 U5.23
EC8_LEFT
  Top 0.152: EC8.B 23.47,76.23 23.47,64.37 22.59,63.48 20.09,63.48 19.18,64.39 | U5.20 17.37,65.18 18.16,64.39 19.18,64.39 | 19.18,64.39 R41.1
EC8_PUSH
  Top 0.152: EC8.PUSH 16.49,70.93 16.49,66.95 17.61,65.83 | R44.1 17.91,65.53 17.78,65.66 17.61,65.83 | U5.21 17.61,65.83
EC8_RIGHT
  Top 0.152: R43.1 6.99,80.12 EC8.D 7.2,78.72 5.92,77.43 5.92,76.2 13.48,68.64 U5.24
EC8_UP
  Top 0.152: R40.1 16.98,68.96 16.98,71.83 16.41,72.4 15.3,72.4 EC8.A 14.78,69.32 U5.22
EC9_PUSH
  Top 0.152: R49.1 8.89,15.79 8.89,11.54 12.32,8.11 19.24,8.11 22,10.87 EC9.D 11.81,22.69 11.81,54.26 10.85,55.22 9.65,55.22 6.35,58.52 6.35,63.25 6.98,63.88 U5.4
EC9_XA
  Top 0.152: R45.1 7.5,15.91 EC9.A1 12.2,7.8 19.36,7.8 23.22,11.66 23.22,13.03 23.88,13.69 23.88,33.56 24.43,34.12 24.43,46.81 24.82,47.2 24.82,51.56 23.78,52.6 23.78,83.28 21.77,85.29 21.77,107.67 23.45,109.35 23.45,125.98 19.86,129.56 U4.28
EC9_XB
  Top 0.152: EC9.B1 7.62,7.5 | 7.62,7.5 19.49,7.5 23.52,11.53 23.52,12.9 24.18,13.56 24.18,33.44 24.74,33.99 24.74,46.69 25.12,47.07 25.12,51.69 24.08,52.73 24.08,83.41 22.07,85.42 22.07,107.55 23.75,109.23 23.75,126.11 19.8,130.06 U4.29 | R46.1 6.9,13.28 6.52,12.9 6.52,12.1 7.64,10.98 7.91,10.98 8.48,10.4 8.48,9.6 7.62,8.74 7.62,7.5
EC9_YA
  Top 0.152: R47.1 26.63,8.09 25.06,6.52 23.96,6.52 23.37,7.11 23.37,7.87 24.52,9.02 24.91,9.02 25.48,9.6 25.48,10.4 24.5,11.38 EC9.A2 24.39,12.61 24.49,12.71 24.49,33.31 25.04,33.87 25.04,46.56 25.43,46.94 25.43,51.81 24.39,52.85 24.39,83.53 22.38,85.55 22.38,107.42 24.06,109.1 24.06,126.23 19.73,130.56 U4.30
EC9_YB
  Top 0.152: 25.78,13.97 25.78,14.27 R48.1 | 25.78,13.97 25.78,8.78 EC9.B2 | U4.31 19.67,131.06 24.36,126.37 24.36,108.97 22.68,107.29 22.68,85.67 24.69,83.66 24.69,52.98 25.73,51.94 25.73,46.82 25.35,46.44 25.35,33.74 24.79,33.18 24.79,14.96 25.78,13.97
EXT1_CS  (via drill 0.35)
  Top 0.152: U4.20 15.99,126.27 16.18,126.09 16.18,125.63 16,125.45 v16,124.97
  Bottom 0.152: v16,124.97 16,124.61 14.77,123.38 11.8,123.38 10.82,122.4 10.82,117.72 13.36,115.18 13.36,109.15 10.01,105.8 10.01,63.78 15.49,58.29 15.49,54.86 12.37,51.74 12.37,46.05 18.66,39.76 18.66,37.73 22.05,34.34 J4.3
EXT2_CS  (via drill 0.35)
  Top 0.152: U4.19 15.49,125.99 v15.62,125.86
  Bottom 0.152: J4.4 20.05,33.42 18.36,35.11 18.36,39.63 12.07,45.92 12.07,51.87 15.19,54.99 15.19,58.17 9.7,63.65 9.7,105.92 13.06,109.28 13.06,115.05 10.51,117.6 10.51,122.53 11.68,123.69 14.65,123.69 15.45,124.49 15.45,125.2 15.62,125.37 v15.62,125.86
EXT3_CS  (via drill 0.35)
  Top 0.152: U4.18 14.99,125.35 v14.86,125.22
  Bottom 0.152: v14.86,125.22 14.86,124.63 14.22,123.99 11.55,123.99 10.21,122.65 10.21,117.47 12.75,114.93 12.75,109.4 9.4,106.05 9.4,63.52 14.88,58.04 14.88,55.11 11.76,52 11.76,45.79 18.05,39.51 J4.5
EXT4_CS  (via drill 0.35)
  Top 0.152: U4.13 12.49,126.16 12.19,125.86 v11.05,125.86 | U5.7 9.23,61.93 9.02,61.72 v9.02,60.96
  Bottom 0.152: v9.02,60.96 8.18,61.8 8.18,106.55 11.53,109.91 11.53,114.42 8.99,116.97 8.99,123.8 v11.05,125.86
GND  (via drill 0.5)
  Top 0.2: SW27.MH3 31.82,171.68 33.32,170.18
  Top 0.3: U4.35 21.68,133.06 v22.1,133.48 | U4.47 12.99,136.11 v12.83,136.27 | U4.23 17.49,125.89 18.16,125.22 v18.54,125.22 | U4.8 9.67,130.06 9.66,130.05 9.14,130.05 8.26,130.94 v8.26,131.7
  Top 0.35: U5.12 13.48,59.56 | 13.48,59.56 13.48,58.31 12.7,57.53 | U5.11 12.83,60.23 12.97,60.09 12.97,60.07 13.48,59.56 | U5.13 14.13,60.21 13.48,59.56 | U5.6 8.66,62.58 8.49,62.41 8.47,62.41 C19.2
  Top 0.4: EC5.C 10.85,190.55 10.16,191.24 | J6.1 28.45,91.94 29.21,92.71 | SW28.4 1.58,171 0.76,170.18 | SW29.4 1.19,56.72 0.76,57.15 | SW31.4 1.52,44.96 0.76,45.72 | SW33.4 0.94,33.2 0.76,33.02 | SW34.3 28.15,33.2 29.24,34.29 | SW32.3 28.45,44.96 29.21,45.72 | EC9.E EC9.C2 | R57.2 R59.2 28.84,173.66 29.21,173.66 29.21,173.84 EC5.E 21.85,190.98 21.59,191.24 | R58.2 28.06,160.49 29.21,159.34 | X1.2 6.43,134.38 C7.2 6.43,132 6.73,131.7 v8.26,131.7 7.71,131.15 C9.2 C8.2 | v19.81,88.39 C17.2 | X1.4 7.91,137.88 7.66,138.13 C6.2 7.66,139.87 v7.75,139.95 | C11.2 C10.2 C20.2 11.85,136.61 12.19,136.27 v12.83,136.27 | C12.2 C13.2 | C15.2 C14.2 C18.2 21.25,122.95 EC7.E | v22.1,133.48 C13.2 | C13.2 C16.2 | EC5.MH3 15,191 15.24,191.24 | EC5.MH2 11.51,179.07 2.03,179.07 0.76,177.8 | EC6.NH3 23.17,148.9 24.13,149.86 29.21,149.86 | EC9.NH3 17.2,4.5 18.14,5.43 | 12.7,57.53 11.18,57.53 8,60.71 C19.2
  Top 0.5: SW27.MH4 29.21,159.34 29.21,149.86 29.21,92.71 29.21,59.69 | 29.21,59.69 29.21,56.24 28.55,55.58 C4.2 27.72,55.58 SW30.3 | SW27.MH2 33.32,170.18 SW27.MH1 | SW27.MH3 29.21,173.66 | 21.59,191.24 15.24,191.24 10.16,191.24 4.55,191.24 0.76,187.45 0.76,177.8 0.76,170.18 0.76,57.15 0.76,45.72 0.76,33.02 0.76,16.74 EC9.C1 5.08,7.58 5.08,6.35 6.35,5.08 11.51,5.08 12.83,6.4 17.17,6.4 18.14,5.43 18.49,5.08 22.86,5.08 | 22.86,5.08 22.86,6.64 EC9.E | 22.86,5.08 26.67,5.08 29.24,7.65 29.24,34.29 29.24,45.69 29.21,45.72 29.21,49.86 | C5.2 28.25,61.45 U6.1 28.49,60.41 29.21,59.69 | 12.7,57.53 12.7,56.26 12.53,56.09 12.53,52.11 13.82,50.83 J5.MH2 | J5.MH2 14.72,50.51 | J5.MH2 16.54,52.32 R60.2 18.73,52.02 19.43,51.32 19.43,51.2 R61.1 22.86,50.8 22.94,50.72 | J5.MH1 22.94,50.72 | 22.94,50.72 22.72,50.51 22.58,50.51 21.93,49.86 21.93,48.94 22.58,48.28 22.72,48.28 J5.MH3 23.04,46.1 20.95,44.01 17.33,44.01 15.24,46.1 15.24,47.77 J5.MH4
  Bottom 0.3: J5.A12 16.29,52.16 16.26,52.2 15.37,52.2 15.04,51.87 J5.MH2 | J5.B1 16.29,46.64 16.13,46.48 15.24,46.48 15.04,46.68 J5.MH4 | J5.A1 21.79,52.27 21.97,52.45 22.73,52.45 23.04,52.14 J5.MH1 | J5.B12 21.79,46.54 21.97,46.35 22.73,46.35 23.04,46.66 J5.MH3
  Bottom 0.4: 29.21,92.71 29.21,175.51 28.45,176.27 25.81,176.27 23.92,178.16 23.92,188.17 21.59,190.5 6.35,190.5 1.27,185.42 1.27,7.62 3.15,5.75 9.76,5.75 12.85,2.65 15.24,2.65 | EC7.C2 17.72,124.42 17.72,125.39 | EC5.E 21.85,165.25 EC6.C2 EC6.E 17.5,148.31 15,145.81 | 15,145.81 EC6.C1 15,138.44 v12.83,136.27 10.98,138.12 | 10.98,138.12 10.41,138.12 9.27,136.97 9.27,132.72 v8.26,131.7 | v18.54,125.22 17.89,125.22 17.72,125.39 | 16.71,36.77 15.49,35.56 11.94,35.56 8.76,32.38 8.76,27.94 10.92,25.78 21.84,25.78 22.99,26.92 22.99,32.51 23.88,33.4 25.65,33.4 26.05,33.01 J4.1 26.05,28.56 27.94,26.67 27.94,6.35 27.34,5.75 20.35,5.75 17.25,2.65 15.24,2.65 | 12.9,85.28 12.9,85.6 EC8.ENC-COM 14.93,87.63 19.05,87.63 v19.81,88.39 | J6.1 27.48,91.06 27.34,90.92 27.34,88.3 17.78,78.74 | 10.98,138.12 9.14,139.95 v7.75,139.95 7.62,139.83 7.62,114.08 EC7.NH2 | 17.72,125.39 17.72,125.61 18.1,125.99 19.11,125.99 22.7,129.58 22.7,132.88 v22.1,133.48 | 22.8,65.98 22.8,65.97 | EC6.NH2 12.59,145.81 15,145.81 | EC5.MH3 EC5.MH2 | EC7.NH3 17.5,115.2 EC7.E | EC9.NH2 9.5,10 EC9.C1 | EC9.NH3 15.24,4.26 15.24,2.65
  Bottom 0.5: EC7.C2 EC7.E 15,116.7 EC7.C1 11.19,100.89 11.19,86.99 12.9,85.28 EC8.COM 14,80.23 14.86,79.38 17.14,79.38 17.78,78.74 EC8.GND 19.32,72.11 19.32,68.58 20.19,68.58 22.8,65.98 24.59,64.18 24.59,63.67 26.54,61.73 26.54,58.26 27.65,57.15 29.21,57.15 | 29.21,92.71 29.21,57.15 | 29.21,57.15 29.21,53.34 | 29.21,53.34 29.21,47.07 26.05,43.91 J4.1 | 29.21,53.34 25.32,53.34 23.04,51.06 J5.MH1
  pour Top: -1.27,193.04 36.83,193.04 36.83,8.89 36.83,-1.27 -1.27,-1.27
  pour Bottom: -2.54,194.31 38.1,194.31 38.1,184.15 38.1,-2.54 2.54,-2.54 -2.54,-2.54
MISO  (via drill 0.35)
  Top 0.152: v12.7,124.59 13.29,125.17 13.56,125.17 13.99,125.6 U4.16 | U5.10 12.18,59.96 v12.32,59.82
  Bottom 0.152: J4.8 13.32,29.21 13.32,28.39 13.76,27.95 16.77,27.95 17.08,28.26 17.08,34.26 17.75,34.92 17.75,39.38 11.46,45.67 11.46,52.12 14.58,55.24 14.58,57.56 v12.32,59.82 9.09,63.04 9.09,106.17 12.45,109.53 12.45,114.8 9.9,117.35 9.9,122.78 11.42,124.3 12.41,124.3 v12.7,124.59
MOSI  (via drill 0.35)
  Top 0.152: v14.1,124.71 14.1,125.25 14.49,125.64 U4.17 | U5.9 11.53,59.72 v12.32,58.93
  Bottom 0.152: J4.7 15.32,29.21 15.32,28.39 15.46,28.25 16.64,28.25 16.78,28.39 16.78,34.38 17.44,35.04 17.44,39.26 11.15,45.54 11.15,52.25 14.27,55.37 14.27,56.98 v12.32,58.93 12.32,59.03 11.76,59.59 11.76,59.79 8.79,62.76 8.79,106.3 12.14,109.66 12.14,114.67 9.6,117.22 9.6,122.9 11.84,125.14 12.93,125.14 13.36,124.71 v14.1,124.71
N$1
  Top 0.152: U5.14 14.78,59.9 14.86,59.82 R24.1
N$3  (via drill 0.35)
  Top 0.152: R60.1 20.45,52.32 21.34,53.21 v21.34,53.72
  Bottom 0.152: J5.A5 19.79,52.81 20.7,53.72 v21.34,53.72
N$4  (via drill 0.35)
  Top 0.152: R61.2 18.16,50.8 17.68,50.31 v17.68,49.4
  Bottom 0.152: v17.68,49.4 17.91,49.4 18.29,49.02 J5.B5
NRST  (via drill 0.35)
  Top 0.152: v9.4,130.68 9.52,130.56 U4.7 | v7.62,93.22 18.41,93.22 v19.68,91.95 19.81,91.82 C17.1
  Bottom 0.152: J6.4 v19.69,91.94 v19.68,91.95 | v7.62,93.22 7.87,93.47 7.87,106.68 11.23,110.03 11.23,114.3 11.1,114.43 11.09,114.43 8.79,116.74 8.68,116.84 8.68,129.97 v9.4,130.68
OSC_IN
  Top 0.152: U4.5 10.68,131.56 8.74,133.5 8.74,135.55 8.61,135.68 7.38,135.68 6.54,136.53 6.54,136.97 6.31,136.75 6.31,136.91 X1.1 6.31,138.01 6.56,138.26 C6.1
OSC_OUT
  Top 0.152: X1.3 7.91,133.86 | 7.91,133.86 7.91,133.09 C7.1 | U4.6 10.71,131.06 7.91,133.86
SCLK  (via drill 0.35)
  Top 0.152: v10.79,59.82 10.88,59.9 U5.8 | U4.15 13.49,125.89 v13.34,125.73
  Bottom 0.152: J4.6 16.05,34.08 17.14,35.17 17.14,39.13 10.85,45.41 10.85,52.38 13.97,55.49 13.97,56.14 10.85,59.25 10.85,59.76 v10.79,59.82 10.79,60.33 8.48,62.64 8.48,106.43 11.84,109.78 11.84,114.55 9.29,117.09 9.29,123.03 11.99,125.73 v13.34,125.73
SW28
  Top 0.152: R50.1 11.88,168 SW28.1 9.92,153.75 4.98,148.81 4.98,75.85 11.53,69.3 U5.27
SW29
  Top 0.152: R51.1 9.92,53.05 SW29.1 9.33,54.3 8.76,54.3 5.44,57.63 5.44,63.65 7.62,65.83 U5.1
SW30
  Top 0.152: R52.1 19.26,53.72 SW30.2 20.32,53.72 22.86,56.26 22.86,57.43 17.06,63.23 U5.17
SW31
  Top 0.152: 10.01,42.06 11.15,43.19 11.15,54.06 10.6,54.61 8.89,54.61 5.74,57.76 5.74,63.5 6.22,63.98 6.22,64.01 7.4,65.18 U5.2 | 10.01,42.06 SW31.1 | R53.1 10.01,41.21 10.01,42.06
SW32
  Top 0.152: SW32.2 20.18,42.05 | R54.1 18.22,42.05 20.18,42.05 | U5.18 16.84,63.88 23.17,57.55 23.17,52.35 24.21,51.31 24.21,47.45 23.82,47.07 23.82,44.15 21.59,41.91 20.32,41.91 20.18,42.05
SW33
  Top 0.152: R55.1 9.92,29.31 SW33.1 11.46,31.74 11.46,54.19 10.73,54.91 9.27,54.91 6.04,58.14 6.04,63.38 7.2,64.53 U5.3
SW34
  Top 0.152: R56.1 19.94,30.06 SW34.2 24.13,34.25 24.13,46.94 24.51,47.32 24.51,51.44 23.47,52.47 23.47,57.68 16.62,64.53 U5.19
SWCLK  (via drill 0.35)
  Top 0.152: U4.37 17.99,135.97 18.41,136.4 23.49,136.4 24.64,135.25 v24.64,132.84
  Bottom 0.152: J6.2 26.23,95.19 24.61,96.8 24.61,132.82 v24.64,132.84
SWDIO  (via drill 0.35)
  Top 0.152: v23.75,131.06 22.25,132.56 U4.34
  Bottom 0.152: J6.3 24.36,92.56 24.36,92.61 24.31,92.67 24.31,130.5 v23.75,131.06
USB_D+  (via drill 0.35)
  Top 0.2: U4.33 19.73,132.06 19.83,132.15 21.01,132.15 v21.34,131.83 | v19.57,49.78 18.92,49.78 18.41,49.28 18.41,46.6 v18.56,46.46
  Bottom 0.2: v21.34,131.83 16.93,127.42 16.93,124.58 15.06,122.7 12.09,122.7 11.5,122.12 11.5,118.01 14.04,115.46 14.04,108.87 10.69,105.51 10.69,79.98 12.71,77.96 12.71,75.71 10.69,73.69 10.69,64.06 19.29,55.46 J5.A6 19.29,50.07 v19.57,49.78 | J5.B6 18.79,46.69 v18.56,46.46
USB_D-  (via drill 0.35)
  Top 0.2: U4.32 20.05,131.56 v20.07,131.57 | v19.07,49.02 19.05,49.01 19.05,46.85 v19.45,46.46
  Bottom 0.2: v20.07,131.57 16.58,128.09 16.58,124.73 14.91,123.06 11.94,123.06 11.14,122.26 11.14,117.86 13.69,115.32 13.69,109.02 10.34,105.66 10.34,79.83 12.36,77.81 12.36,75.86 10.34,73.84 10.34,63.91 18.79,55.46 J5.A7 18.79,49.3 v19.07,49.02 | J5.B7 19.29,46.61 v19.45,46.46
VCAP
  Top 0.3: U4.22 16.99,125 18.8,123.19 C18.1